# EAGLE design bargraph_power_supply (EAGLE 9.2.0)
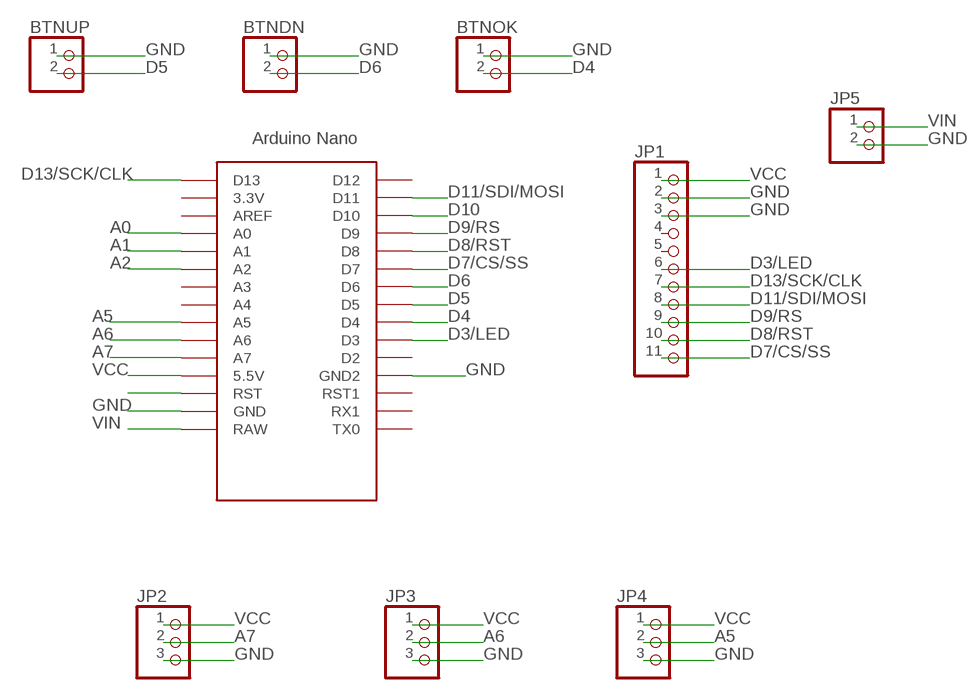
[diagram p0: schematic, sheet 1]

## Parts
BTNDN  PINHD-1X2  [1X02]
BTNOK  PINHD-1X2  [1X02]
BTNUP  PINHD-1X2  [1X02]
JP1  PINHD-1X11  [1X11]
JP2  PINHD-1X3  [1X03]
JP3  PINHD-1X3  [1X03]
JP4  PINHD-1X3  [1X03]
JP5  PINHD-1X2  [1X02]
U$1  NANO  [NANO]

## Nets
A0: U$1.A0
A1: U$1.A1
A2: U$1.A2
A5: JP4.2 U$1.A5
A6: JP3.2 U$1.A6
A7: JP2.2 U$1.A7
D3/LED: JP1.6 U$1.D3
D4: BTNOK.2 U$1.D4
D5: BTNUP.2 U$1.D5
D6: BTNDN.2 U$1.D6
D7/CS/SS: JP1.11 U$1.D7
D8/RST: JP1.10 U$1.D8
D9/RS: JP1.9 U$1.D9
D10: U$1.D10
D11/SDI/MOSI: JP1.8 U$1.D11
D13/SCK/CLK: JP1.7 U$1.D13
GND: BTNDN.1 BTNOK.1 BTNUP.1 JP1.2 JP1.3 JP2.3 JP3.3 JP4.3 JP5.2 U$1.GND U$1.GND1(GND2)
N$4: U$1.RST
VCC: JP1.1 JP2.1 JP3.1 JP4.1 U$1.5V(5.5V)
VIN: JP5.1 U$1.RAW
Unconnected: JP1.4 JP1.5 U$1.3.3V U$1.A3 U$1.A4 U$1.AREF U$1.D2 U$1.D12 U$1.ICSP1 U$1.ICSP2 U$1.ICSP3 U$1.ICSP4 U$1.ICSP5 U$1.ICSP6 U$1.RST1 U$1.RX1 U$1.TX0

## Library data of the parts
BTNDN BTNOK BTNUP JP5 = pinhead:PINHD-1X2: PIN HEADER
JP1 = pinhead:PINHD-1X11: PIN HEADER
JP2-JP4 = pinhead:PINHD-1X3: PIN HEADER
U$1 = Arduino-clone:NANO: Arduino Nano

## Net classes
0 default: width 0.914 mm, clearance 0.1 mm

## Board
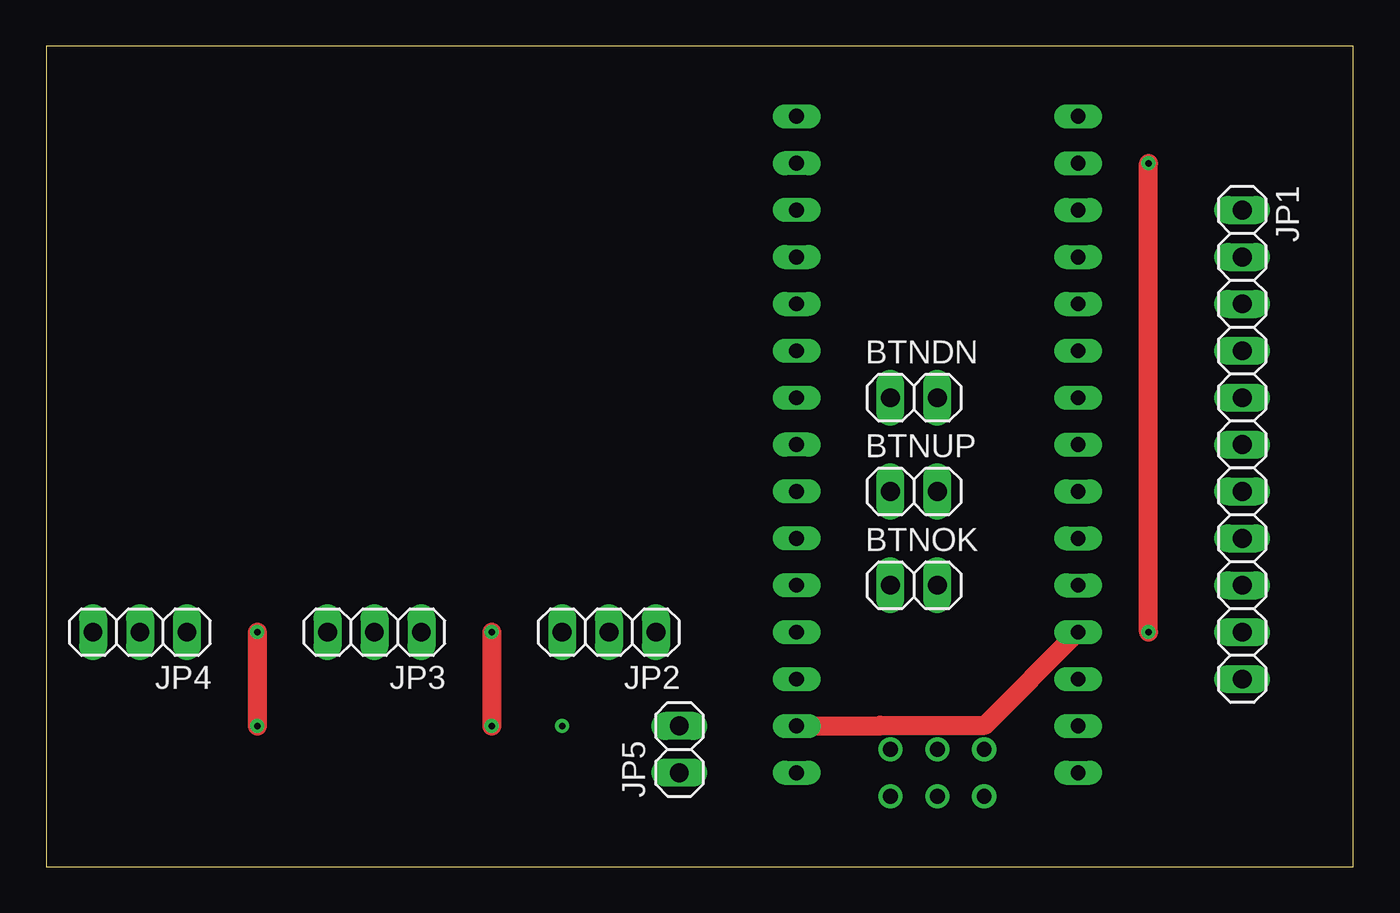
[diagram p1: board, top side]
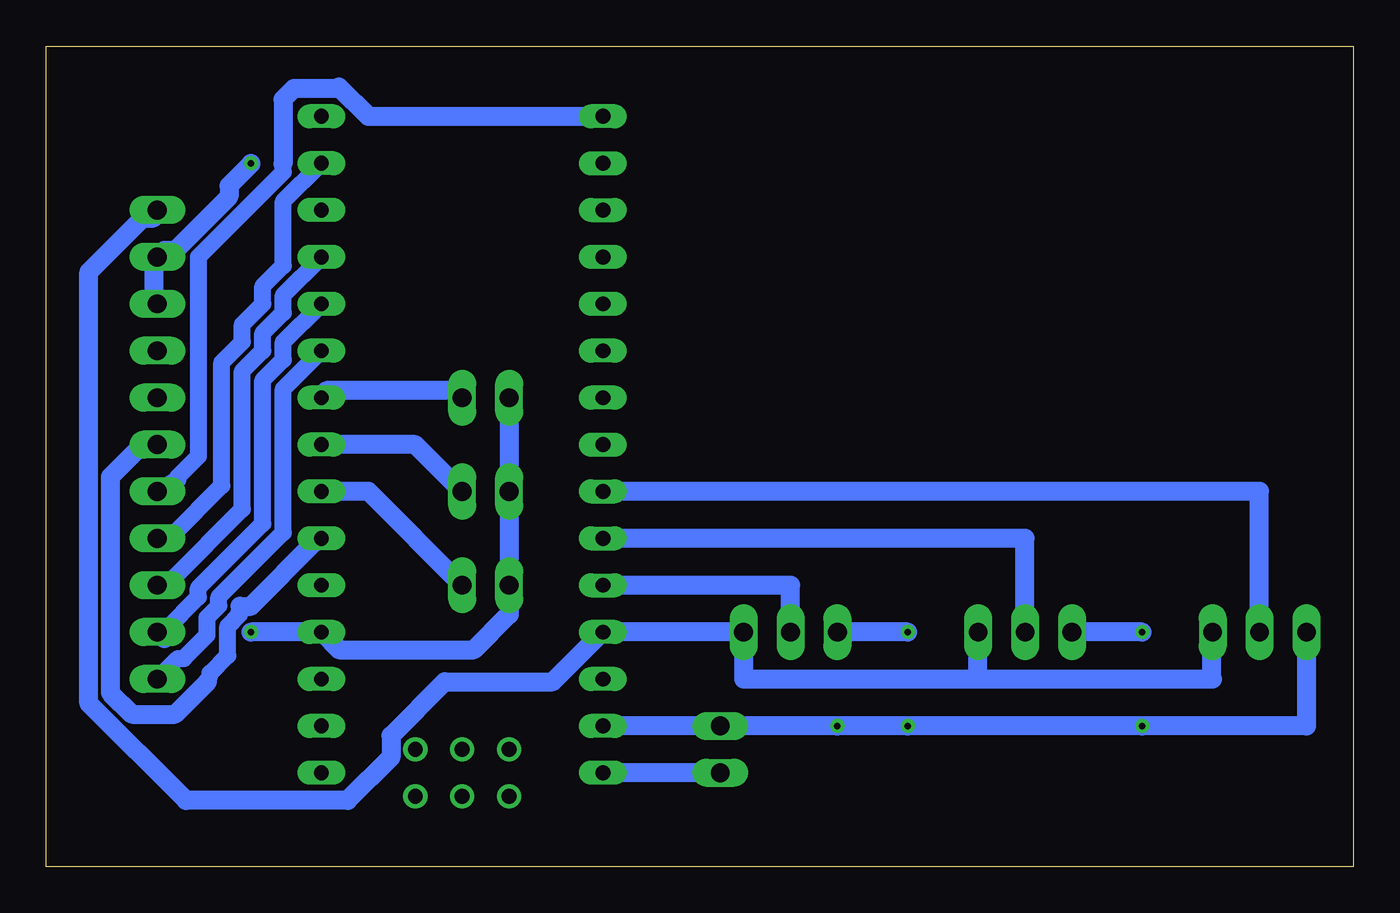
[diagram p2: board, bottom side, seen from below]

Size 70.79 x 44.44 mm. Coordinates in mm from the lower left corner, seen from the top.
Outline: 0,0 70.79,0 70.79,44.44 0,44.44 0,0
Copper layers (1*16): Top 0.035mm / dielectric 1.5mm / Bottom 0.035mm
Design rules "default": minimum track width 6mil, minimum drill 0.35mm, track to track 6mil, track to pad 6mil, pad to pad 6mil, via to via 6mil, smd to smd 6mil, copper to edge 40mil, drill to drill 6mil, minimum pad ring 10mil, minimum via ring 8mil, stop-mask expansion 4mil, vias tented up to drill 0mil, thermal gap 10mil

### Footprints (pad centres in the part's own frame; a part is rotated, then mirrored left to right if it is on the bottom)
1X02 = drill 1.016 long: 1 -1.27,0; 2 1.27,0
1X11 = drill 1.016 long: 1 -12.7,0; 2 -10.16,0; 3 -7.62,0; 4 -5.08,0; 5 -2.54,0; 6 0,0; 7 2.54,0; 8 5.08,0; 9 7.62,0; 10 10.16,0; 11 12.7,0
1X03 = drill 1.016 long: 1 -2.54,0; 2 0,0; 3 2.54,0
NANO = drill 0.8 long: 3.3V -10.16,24.13; 5V -10.16,-1.27; A0 -10.16,19.05; A1 -10.16,16.51; A2 -10.16,13.97; A3 -10.16,11.43; A4 -10.16,8.89; A5 -10.16,6.35; A6 -10.16,3.81; A7 -10.16,1.27; AREF -10.16,21.59; D2 5.08,1.27; D3 5.08,3.81; D4 5.08,6.35; D5 5.08,8.89; D6 5.08,11.43; D7 5.08,13.97; D8 5.08,16.51; D9 5.08,19.05; D10 5.08,21.59; D11 5.08,24.13; D12 5.08,26.67; D13 -10.16,26.67; GND -10.16,-6.35; GND1 5.08,-1.27; RAW -10.16,-8.89; RST -10.16,-3.81; RST1 5.08,-3.81; RX1 5.08,-6.35; TX0 5.08,-8.89 | drill 0.8: ICSP1 -5.08,-10.16; ICSP2 -5.08,-7.62; ICSP3 -2.54,-10.16; ICSP4 -2.54,-7.62; ICSP5 0,-10.16; ICSP6 0,-7.62

### Placement (x,y rotation side)
BTNDN  46.99,25.4 0 top
BTNOK  46.99,15.24 0 top
BTNUP  46.99,20.32 0 top
JP1  64.77,22.86 270 top
JP2  30.48,12.7 180 top
JP3  17.78,12.7 180 top
JP4  5.08,12.7 180 top
JP5  34.29,6.35 90 top
U$1  50.8,13.97 0 top

### Tracks (layer width: path | path; a pad name or v marks a point on that pad's centre or on a via)
A5
  Bottom 1.016: JP4.2 5.08,20.32 U$1.A5
A6
  Bottom 1.016: JP3.2 17.78,17.78 U$1.A6
A7
  Bottom 1.016: JP2.2 30.48,15.24 U$1.A7
D3/LED
  Bottom 0.914: 60.3,14.1 60.32,13.65 60.96,13.02 60.96,11.43 61.91,10.48 62.05,10.01
  Bottom 1.016: 60.3,14.1 59.71,14.1 56.21,17.6 U$1.D3 | 62.05,10.01 63.8,8.26 66.14,8.26 67.31,9.42 67.31,21.11 65.56,22.86 JP1.6
D4
  Bottom 1.016: U$1.D4 53.34,20.32 BTNOK.2
D5
  Bottom 1.016: BTNUP.2 50.8,22.86 U$1.D5
D6
  Bottom 1.016: U$1.D6 55.63,25.78 48.62,25.78 BTNDN.2
D7/CS/SS
  Bottom 0.914: U$1.D7 57.94,25.88 57.94,18.1 61.44,14.6 61.44,14.13 62.07,13.49 62.07,12.54 63.34,11.27 63.66,11.27 JP1.11
D8/RST
  Bottom 0.914: U$1.D8 57.94,28.42 57.94,27.46 59.05,26.35 59.05,18.57 62.55,15.08 62.55,14.6 64.29,12.86 JP1.10
  Bottom 1.016: 56.21,30.45 U$1.D8 | 64.39,12.34 JP1.10
D9/RS
  Bottom 0.914: U$1.D9 57.94,30.96 57.94,30 59.05,28.89 59.05,27.94 60.17,26.83 60.17,19.37 63.98,15.56 JP1.9
  Bottom 1.016: 56.21,32.79 U$1.D9 | 64.39,15.26 JP1.9
D11/SDI/MOSI
  Bottom 0.914: U$1.D11 57.94,36.04 57.94,32.54 59.05,31.43 59.05,30.48 60.17,29.37 60.17,28.42 61.28,27.3 61.28,20.64 63.98,17.94 JP1.8
  Bottom 1.016: 56.21,38.05 U$1.D11 | 64.39,17.6 JP1.8
D13/SCK/CLK
  Bottom 0.914: JP1.7 63.66,20.95 63.66,21.11 62.55,22.23 62.55,33.02 57.94,37.62 57.96,38.05
  Bottom 1.016: U$1.D13 53.34,40.64 54.93,42.23 55.04,42.14 57.38,42.14 57.96,41.55 57.96,38.05 | 63.8,20.52 64.39,20.52 JP1.7
GND  (via drill 0.35)
  Top 1.016: U$1.GND 45.13,7.62 45.18,7.66 50.84,7.66 U$1.GND1 | v11.43,12.7 v11.43,7.62 | v24.13,12.7 v24.13,7.62 | v59.69,12.7 v59.69,38.1
  Bottom 1.016: BTNDN.1 BTNUP.1 BTNOK.1 45.72,13.65 47.62,11.75 54.93,11.75 U$1.GND1 v59.69,12.7 | JP4.3 2.54,7.62 v11.43,7.62 v24.13,7.62 v27.94,7.62 JP5.2 U$1.GND | JP1.3 64.97,31.04 64.97,32.79 JP1.2 64.39,33.38 63.8,33.38 60.88,36.3 60.88,36.88 59.71,38.05 v59.69,38.1 | v11.43,12.7 JP3.3 | v24.13,12.7 JP2.3
VCC
  Bottom 1.016: JP4.1 7.67,12.24 7.67,10.21 7.62,10.16 20.32,10.16 | 20.32,10.16 33.02,10.16 JP2.1 U$1.5V 40.66,12.7 43.36,10.01 49.2,10.01 52.12,7.09 52.12,5.92 54.46,3.58 63.22,3.58 68.48,8.84 68.48,32.21 65.56,35.13 64.97,35.13 JP1.1 | 20.32,10.16 JP3.1
VIN
  Bottom 1.016: JP5.1 U$1.RAW